# Altium project PCB_Fuente_DC_DC.PrjPcb
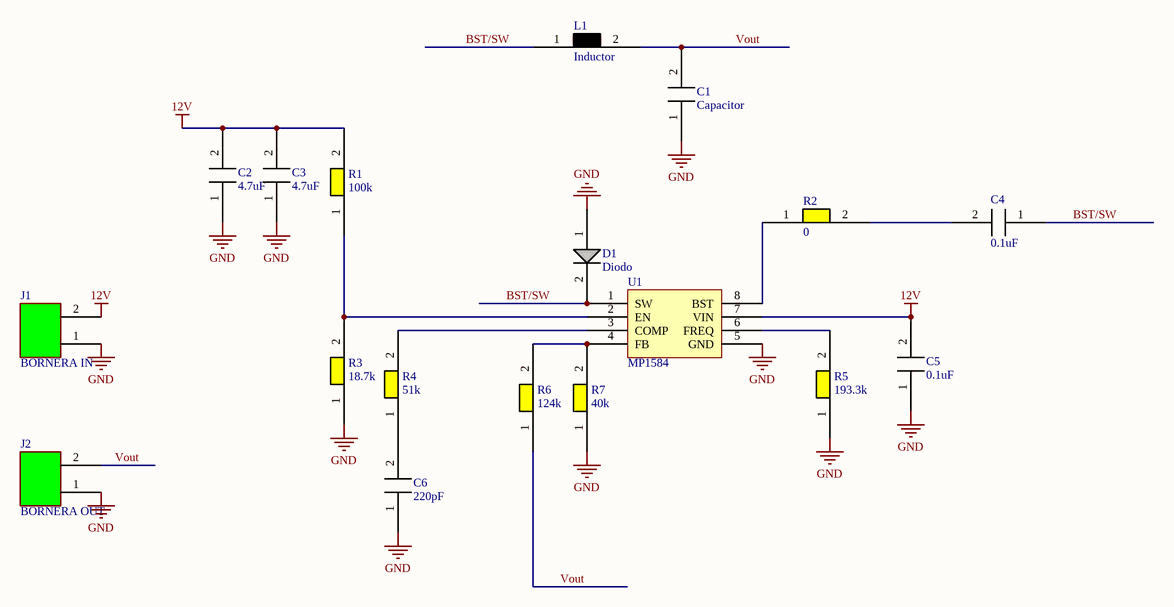
[diagram p0: Sheet1.SchDoc]
1 sheet, 18 parts. Net scope: global (net labels, ports and power ports of the same name join across sheets).
Board file: PCB_DCDC.PcbDoc

## Sheet Sheet1.SchDoc
size A4; SheetNumber: 1; SheetTotal: 1

### Parts
C1  Capacitor  [0805]
C2  4.7uF  [0805]
C3  4.7uF  [0805]
C4  0.1uF  [0805]
C5  0.1uF  [0805]
C6  220pF  [0805]
D1  Diodo  [SMA]
J1  BORNERA IN  [Bornera]
J2  BORNERA OUT  [Bornera]
L1  Inductor  [SMT]
R1  100k  [0805]
R2  0  [0805]
R3  18.7k  [0805]
R4  51k  [0805]
R5  193.3k  [0805]
R6  124k  [0805]
R7  40k  [0805]
U1  MP1584  [SOP8]

### Nets
12V: C2.2 C3.2 C5.2 J1.2 R1.2 U1.7(VIN)
GND: C1.1 C2.1 C3.1 C5.1 C6.1 D1.1 J1.1 J2.1 R3.1 R5.1 R7.1 U1.5(GND)
BST/SW: C4.1 D1.2 L1.1 U1.1(SW)
Vout: C1.2 J2.2 L1.2 R6.1
NetC4_2: C4.2 R2.2
NetC6_2: C6.2 R4.1
NetR1_1: R1.1 R3.2 U1.2(EN)
NetR2_1: R2.1 U1.8(BST)
NetR4_2: R4.2 U1.3(COMP)
NetR5_2: R5.2 U1.6(FREQ)
NetR6_2: R6.2 R7.2 U1.4(FB)

### Library data of the parts
C2-C6 = Capacitor
J1 J2 = Bornera
R1-R7 = Resistencia
U1 = MP1584: CHIP DE FUENTE